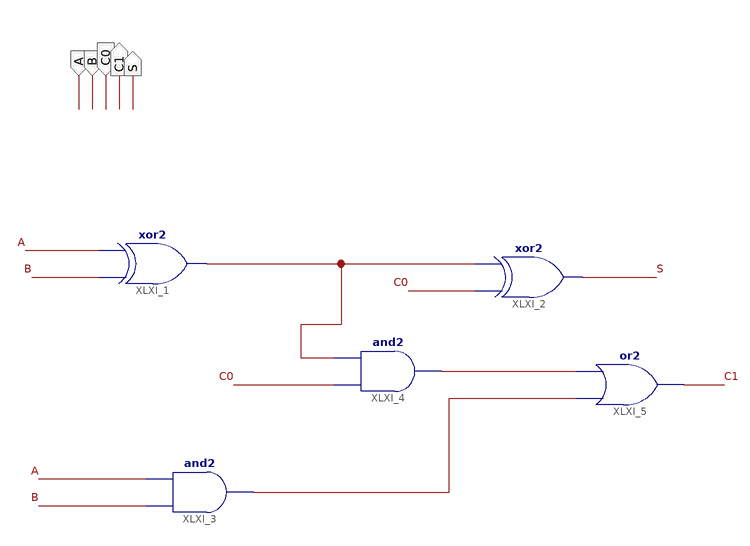
[diagram p0: schematic sheet 1]
// Xilinx ISE schematic Sumador.sch (spartan6) as structural Verilog: 5 symbols, 5 ports
module Sumador (
  input  A,
  input  B,
  input  C0,
  output S,
  output C1
);

  wire XLXN_6, XLXN_7, XLXN_8;

  xor XLXI_1 (XLXN_8, B, A);
  xor XLXI_2 (S, C0, XLXN_8);
  and XLXI_3 (XLXN_6, B, A);
  and XLXI_4 (XLXN_7, C0, XLXN_8);
  or XLXI_5 (C1, XLXN_6, XLXN_7);
endmodule
